# EAGLE design zero_board (EAGLE 9.5.2)
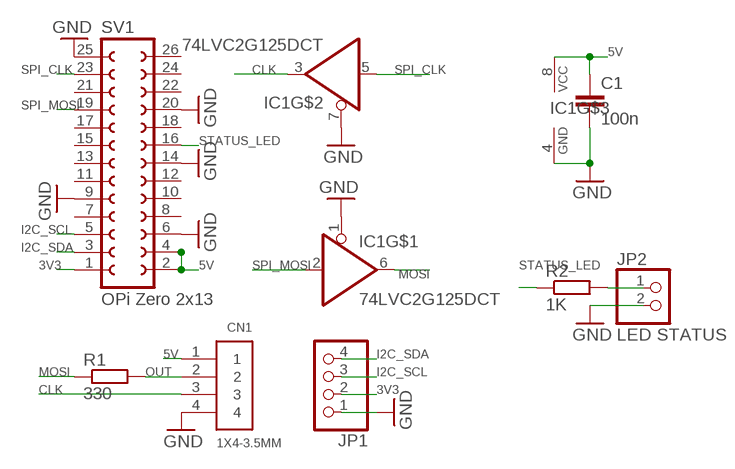
[diagram p0: schematic, sheet 1]

## Parts
C1  100n  C-EUC0805  [C0805]
CN1  1X4-3.5MM  [1X04-3.5MM]
IC1  74LVC2G125DCT  [SSOP08]
JP1  PINHD-1X4  [1X04]
JP2  LED STATUS  PINHD-1X2  [1X02]
R1  330  R-EU_R0805  [R0805]
R2  1K  R-EU_R0805  [R0805]
SV1  OPi Zero 2x13  FE13-2  [FE13-2]

## Nets
3V3: JP1.2 SV1.1
5V: C1.1 CN1.1 IC1.8(VCC) SV1.2 SV1.4
CLK: CN1.3 IC1.3(O)
GND: C1.2 CN1.4 IC1.1(OE) IC1.4(GND) IC1.7(OE) JP1.1 JP2.2 SV1.6 SV1.9 SV1.14 SV1.20 SV1.25
I2C_SCL: JP1.3 SV1.5
I2C_SDA: JP1.4 SV1.3
MOSI: IC1.6(O) R1.1
N$3: JP2.1 R2.2
OUT: CN1.2 R1.2
SPI_CLK: IC1.5(I) SV1.23
SPI_MOSI: IC1.2(I) SV1.19
STATUS_LED: R2.1 SV1.16
Unconnected: SV1.7 SV1.8 SV1.10 SV1.11 SV1.12 SV1.13 SV1.15 SV1.17 SV1.18 SV1.21 SV1.22 SV1.24 SV1.26

## Library data of the parts
C1 = rcl:C-EU: CAPACITOR, European symbol
CN1 = adafruit:1X4: 4-pin connector
IC1 = 74xx-little-de:74*2G125: Dual line drivers with 3-state outputs.
JP1 = pinhead:PINHD-1X4: PIN HEADER
JP2 = pinhead:PINHD-1X2: PIN HEADER
R1 R2 = rcl:R-EU_: RESISTOR, European symbol
SV1 = con-lsta:FE13-2: FEMALE HEADER; OC_FARNELL: unknown; OC_NEWARK: unknown

## Board
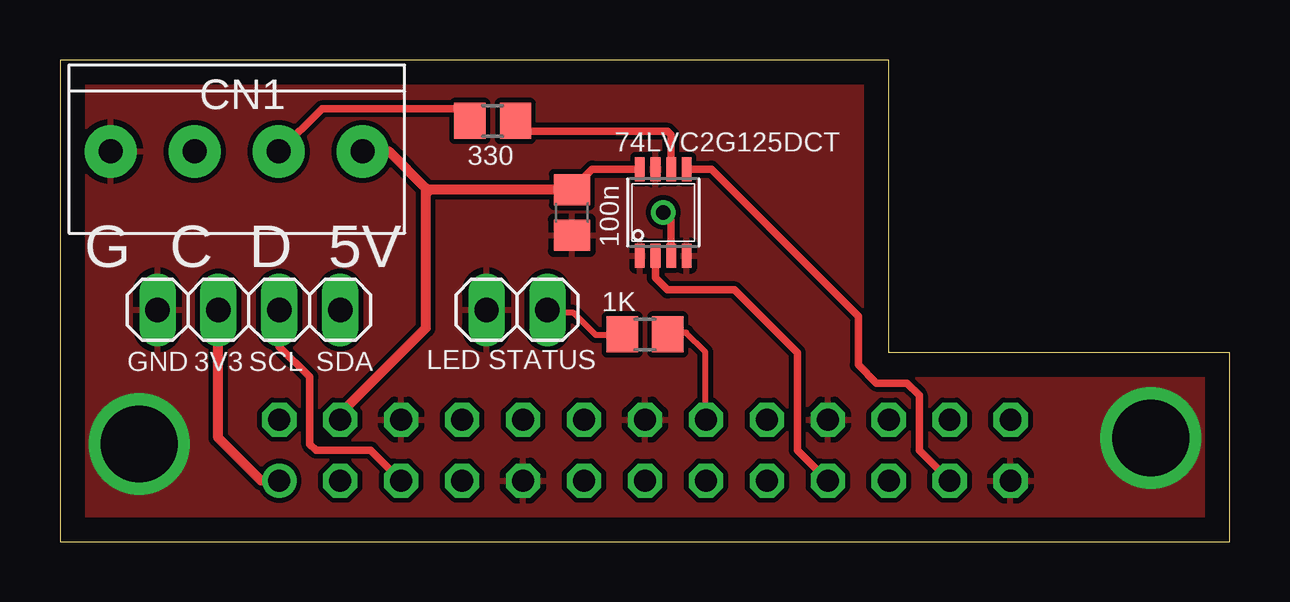
[diagram p1: board, top side]
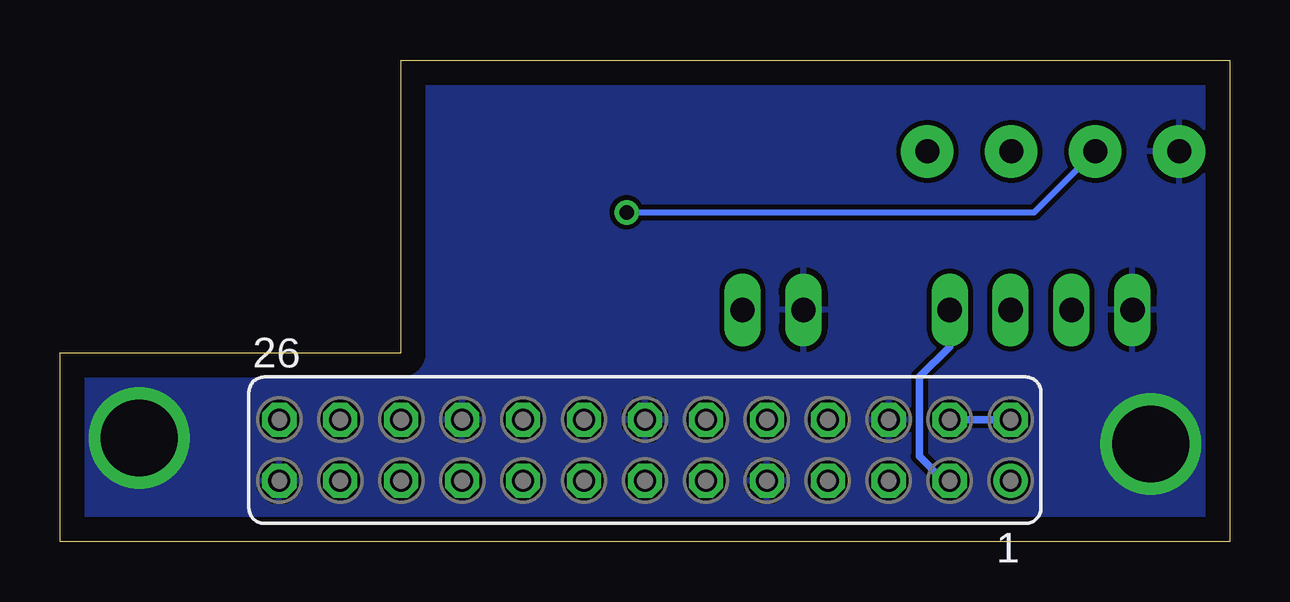
[diagram p2: board, bottom side, seen from below]

Size 48.77 x 20.07 mm. Coordinates in mm from the lower left corner, seen from the top.
Outline: 0,20.06 0,0 48.77,0 48.77,7.87 34.54,7.87 34.54,20.07 0,20.07
Copper layers (1*16): Top 0.035mm / dielectric 1.5mm / Bottom 0.035mm
Design rules "default": minimum track width 10mil, minimum drill 24mil, track to track 8mil, track to pad 8mil, pad to pad 8mil, via to via 8mil, smd to smd 8mil, copper to edge 40mil, drill to drill 8mil, minimum pad ring 10mil, minimum via ring 8mil, stop-mask expansion 4mil, vias tented up to drill 0mil, thermal gap 10mil

### Footprints (pad centres in the part's own frame; a part is rotated, then mirrored left to right if it is on the bottom)
C0805 = smd 1.3 x 1.5: 1 -0.95,0; 2 0.95,0
1X04-3.5MM = drill 1 pad 2.184: 1 -5.25,0; 2 -1.75,0; 3 1.75,0; 4 5.25,0
SSOP08 = smd 0.4 x 1: 1 -0.975,-1.8; 2 -0.325,-1.8; 3 0.325,-1.8; 4 0.975,-1.8; 5 0.975,1.8; 6 0.325,1.8; 7 -0.325,1.8; 8 -0.975,1.8
1X04 = drill 1.016 long: 1 -3.81,0; 2 -1.27,0; 3 1.27,0; 4 3.81,0
1X02 = drill 1.016 long: 1 -1.27,0; 2 1.27,0
R0805 = smd 1.3 x 1.5: 1 -0.95,0; 2 0.95,0
FE13-2 = drill 0.914: 1 -15.24,1.27 | drill 0.914 octagon: 2 -15.24,-1.27; 3 -12.7,1.27; 4 -12.7,-1.27; 5 -10.16,1.27; 6 -10.16,-1.27; 7 -7.62,1.27; 8 -7.62,-1.27; 9 -5.08,1.27; 10 -5.08,-1.27; 11 -2.54,1.27; 12 -2.54,-1.27; 13 0,1.27; 14 0,-1.27; 15 2.54,1.27; 16 2.54,-1.27; 17 5.08,1.27; 18 5.08,-1.27; 19 7.62,1.27; 20 7.62,-1.27; 21 10.16,1.27; 22 10.16,-1.27; 23 12.7,1.27; 24 12.7,-1.27; 25 15.24,1.27; 26 15.24,-1.27

### Placement (x,y rotation side)
C1  21.34,13.72 270 top
CN1  7.37,16.26 180 top
IC1  25.15,13.72 0 top
JP1  7.87,9.65 0 top
JP2  19.05,9.65 180 top
R1  18.03,17.53 180 top
R2  24.38,8.64 180 top
SV1  24.38,3.81 180 bottom

### Tracks (layer width: path | path; a pad name or v marks a point on that pad's centre or on a via)
3V3
  Top 0.406: SV1.1 8.38,2.54 6.6,4.32 JP1.2
5V
  Top 0.305: C1.1 22.19,15.52 IC1.8
  Top 0.406: C1.1 15.43,14.67 15.24,14.48 | 15.24,14.48 15.24,8.89 11.68,5.33 SV1.4 | CN1.1 13.72,16.26 15.24,14.73 15.24,14.48
  Bottom 0.305: SV1.2 SV1.4
CLK  (via drill 0.61)
  Top 0.305: v25.15,13.72 25.47,13.39 IC1.3
  Bottom 0.254: CN1.3 8.16,13.72 v25.15,13.72
GND  (via drill 3.2)
  other vias: 3.3,4.06 45.47,4.32
  pour Bottom: 0,0 48.77,0 48.77,7.87 34.54,7.87 34.54,20.07 0,20.07
  pour Top: 0,0 48.77,0 48.77,7.87 34.54,7.87 34.54,20.07 0,20.07
I2C_SCL
  Top 0.305: SV1.5 12.95,3.81 10.67,3.81 10.41,4.06 10.41,6.86 9.14,8.13 JP1.3
I2C_SDA
  Bottom 0.305: SV1.3 11.94,2.54 12.95,3.56 12.95,6.86 11.68,8.13 JP1.4
MOSI
  Top 0.254: 25.53,15.7 IC1.6
  Top 0.305: R1.1 19.42,17.09 25.32,17.09 25.47,16.95 IC1.6
N$3
  Top 0.254: JP2.1 20.45,9.52 21.41,9.52 22.33,8.61 23.55,8.61 R2.2
OUT
  Top 0.305: R1.2 16.58,18.03 10.92,18.03 9.14,16.26 CN1.2
SPI_CLK
  Top 0.254: IC1.5 26.12,15.53
  Top 0.305: IC1.5 27.16,15.52 33.27,9.4 33.27,7.37 34.04,6.6 35.31,6.6 35.81,6.1 35.81,3.81 SV1.23
SPI_MOSI
  Top 0.305: SV1.19 30.73,3.81 30.73,7.87 28.12,10.49 25.32,10.49 24.82,10.99 IC1.2
STATUS_LED
  Top 0.254: R2.1 25.4,8.7 26.1,8.7 26.9,7.9 26.9,5.18 SV1.16

### Text on the board
tPlace: G | C | D | 5V | GND | 3V3 | SCL | SDA